# Altium project ESD_Battery-Monitor-System.PrjPcb
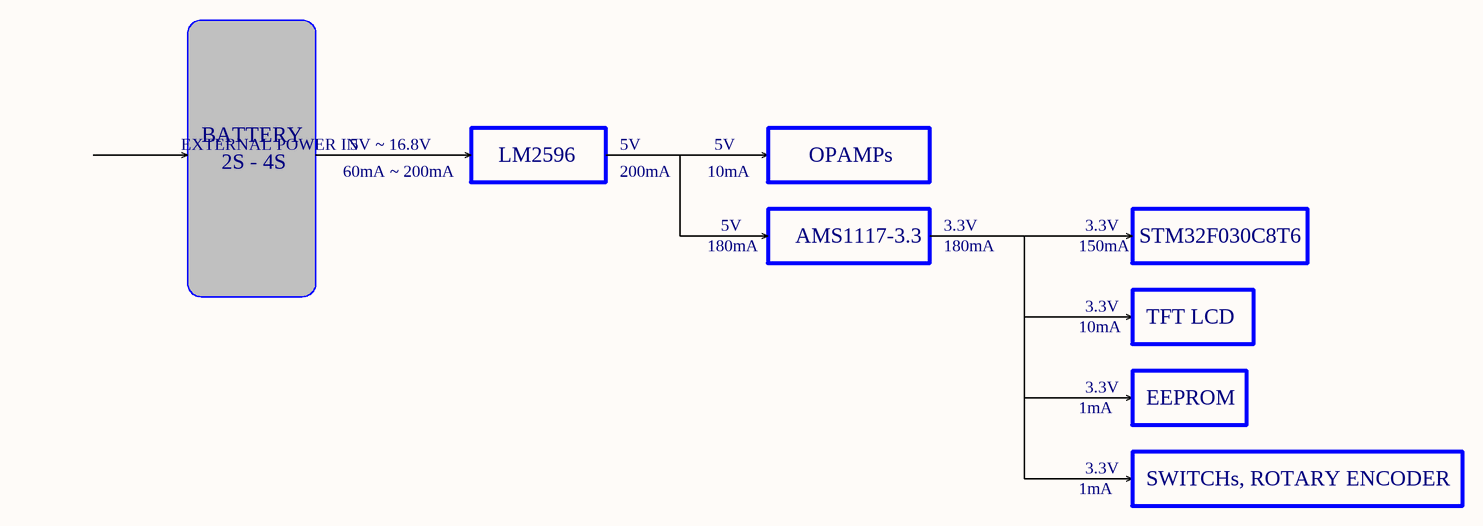
[diagram p0: Power_Diagram.SchDoc]
3 sheets, 101 parts. Net scope: global (net labels, ports and power ports of the same name join across sheets).
Board file: PCB_v1.PcbDoc
Sheets:
  Power_Diagram.SchDoc
  Power_Supply.SchDoc
  Voltage_Battery_Measure.SchDoc

## Sheet Power_Diagram.SchDoc
size A4; SheetNumber: 1; SheetTotal: 2

### Notes on the sheet
- EXTERNAL POWER IN
- BATTERY
- 2S - 4S
- 60mA ~ 200mA
- 5V ~ 16.8V
- LM2596
- 5V
- 200mA
- 10mA
- OPAMPs
- AMS1117-3.3
- 3.3V
- STM32F030C8T6
- 180mA
- 150mA
- TFT LCD
- 1mA
- EEPROM
- SWITCHs, ROTARY ENCODER

## Sheet Power_Supply.SchDoc
size A4; SheetNumber: 2; SheetTotal: 3
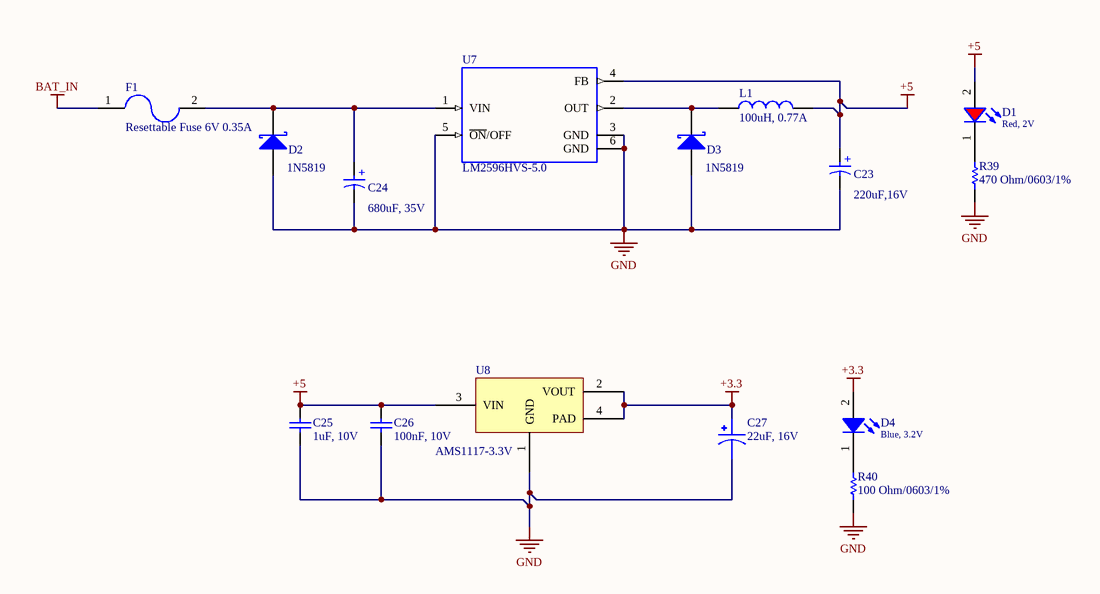
[diagram p1: Power_Supply.SchDoc]

### Parts
C23  value 220uF,16V  [WCAP-ASLI_D6.3H7.7]  (hidden comment: 220uF)
C24  value 680uF, 35V  [WCAP-ASLI_D12.5H14]  (hidden comment: 680uF)
C25  1uF, 10V  [WCAP-CSGP_0603_H=0.8mm_Reflow]
C26  100nF, 10V  [WCAP-CSGP_0603_H=0.8mm_Reflow]
C27  value 22uF, 16V  [C2312]  (hidden comment: Tantalum Capacitor)
D1  Red, 2V  [WL-SMCW_0603 dome]
D2  value 1N5819  [SS34]  (hidden comment: D Schottky)
D3  value 1N5819  [SS34]  (hidden comment: D Schottky)
D4  Blue, 3.2V  [WL-SMCW_0603_H=0.7mm]
F1  value Resettable Fuse 6V 0.35A  [FUSE1206]  (hidden comment: RESETTABLE FUSE 1206)
L1  100uH, 0.77A  [WE-PD2A_7850]
R39  value 470 Ohm/0603/1%  [R0603]  (hidden comment: Resistor 470 Ohm 0603 1%)
R40  value 100 Ohm/0603/1%  [R0603]  (hidden comment: Resistor 100 Ohm 0603 1%)
U7  value LM2596HVS-5.0  [TO-263-5]  (hidden comment: LM2596)
U8  AMS1117-3.3V  [SOT230P700X180-4N]

### Nets
+3.3: C27.1 D4.2(A) U8.2(VOUT) U8.4(PAD)
+5: C23.1(P) C25.2 C26.2 D1.2(A) L1.2 U7.4(FB) U8.3(VIN)
BAT_IN: F1.1  [project net SHUNT+]
GND: C23.2(N) C24.2(N) C25.1 C26.1 C27.2 D2.1(A) D3.1(A) R39.1 R40.1 U7.3(GND) U7.5(~{ON}/OFF) U7.6(GND) U8.1(GND)
NetC24_1: C24.1(P) D2.2(K) F1.2 U7.1(VIN)
NetD1_1: D1.1(K) R39.2
NetD3_2: D3.2(K) L1.1 U7.2(OUT)
NetD4_1: D4.1(K) R40.2

### Notes on the sheet
- (in symbol 865080345012) +
- (in symbol 865080562017) +

### Library data of the parts
C23 = 865080345012: WCAP-ASLI Aluminum Electrolytic Capacitor, V-Chip, D6.3 x H7.7mm, 220uF, 16V; Manufacturer: Wurth Elektronik; Capacitance Tolerance: +/-20%; Dissipation Factor: 16%; Endurance: 2000h; Leakage Current: 35.2uA; Ripple Current: 275mA; Technical Reference: ASED077221M016DVCTCB000; Manufacturer Part Number: 865080345012; Category: Aluminum Electrolytic Capacitors; Match Code: WCAP-ASLI; ComponentLink1Description: Website Link; ComponentLink1URL: https://www.we-online.com/redexpert/article/865080345012?ad; ComponentLink2Description: Datasheet Link; ComponentLink2URL: https://www.we-online.com/redexpert/spec/865080345012?ad; Mount: Surface Mount; Operating Temperature Max: 105°C; Operating Temperature Min: -55°C; Packaging: Tape and Reel; Height: 7.7mm; Diameter: 6.3mm; Rated Voltage (DC): 16V
C24 = 865080562017: WCAP-ASLI Aluminum Electrolytic Capacitor, V-Chip, D12.5 x H14mm, 680uF, 35V; Manufacturer: Wurth Elektronik; Capacitance Tolerance: +/-20%; Dissipation Factor: 14%; Endurance: 5000h; Leakage Current: 238uA; Ripple Current: 1100mA; Technical Reference: ASEH140681M035DVCTGE000; Manufacturer Part Number: 865080562017; Category: Aluminum Electrolytic Capacitors; Match Code: WCAP-ASLI; ComponentLink1Description: Website Link; ComponentLink1URL: https://www.we-online.com/redexpert/article/865080562017?ad; ComponentLink2Description: Datasheet Link; ComponentLink2URL: https://www.we-online.com/redexpert/spec/865080562017?ad; Mount: Surface Mount; Operating Temperature Max: 105°C; Operating Temperature Min: -55°C; Packaging: Tape and Reel; Height: 14mm; Diameter: 12.5mm; Rated Voltage (DC): 35V
C25 = 885012106010: WCAP-CSGP Multilayer Ceramic Chip Capacitor, General Purpose, size 0603, X5R, 1uF, 10V; Manufacturer: Wurth Elektronik; Rated Voltage: 10VDC; Isolation Resistance: >=0.1GOhm; Capacitance Tolerance: +/-20%; Technical Reference: X5R0603105M010DFCT10000; ComponentLink1Description: Manufacturer; ComponentLink1URL: http://www.we-online.de; ComponentLink2Description: Datasheet; ComponentLink2URL: https://www.we-online.com/catalog/datasheet/885012106010.pdf; Operating Temperature: -55 to +85degC; Packaging: Tape and Reel; Manufacturer Part Number: 885012106010; Published Date: May 2020; Ceramic Type: X5R; Dissipation Factor: =<10%; Height: 0.8mm; Mounting Technology: SMT; Size: 0603; Capacitance: 1uF
C26 = 885012206020: WCAP-CSGP Multilayer Ceramic Chip Capacitor, General Purpose, size 0603, X7R, 100nF, 10V; Manufacturer: Wurth Elektronik; Rated Voltage: 10VDC; Isolation Resistance: >=5GOhm; Capacitance Tolerance: +/-10%; Technical Reference: X7R0603104K010DFCT10000; ComponentLink1Description: Manufacturer; ComponentLink1URL: http://www.we-online.de; ComponentLink2Description: Datasheet; ComponentLink2URL: https://www.we-online.com/catalog/datasheet/885012206020.pdf; Operating Temperature: -55 to +125degC; Packaging: Tape and Reel; Manufacturer Part Number: 885012206020; Published Date: May 2020; Ceramic Type: X7R; Dissipation Factor: =<5%; Height: 0.8mm; Mounting Technology: SMT; Size: 0603; Capacitance: 100nF
C27 = Tantalum Capacitor: Code 226 10%, 2312 (6032 Metric); MF: AVX; MP: TAJC226K016RNJ; Mouser-Purchase-URL: https://snapeda.com/shop?store=Mouser&id=1681916; Price: None; Package: 2312 AVX; Availability: Warning; SnapEDA_Link: https://www.snapeda.com/parts/TAJC226K016RNJ/AVX/view-part/1681916/?ref=snap
D1 = 150060RS86000: WL-SMCW SMT Mono-color Chip LED Waterclear, size 0603 dome, Red, 2V, 60deg; Chip Technology: AlInGaP; Dominant Wavelength typ.: 624nm; Luminous Intensity typ.: 800mcd; Peak Wavelength typ.: 632nm; Viewing Angle: 60deg; ComponentLink1Description: Manufacturer; ComponentLink1URL: http://www.we-online.de; ComponentLink2URL: https://www.we-online.com/catalog/datasheet/150060RS86000.pdf; ComponentLink2Description: Datasheet; Forward Voltage typ.: 2V; Emitting Color: Red; Mounting Technology: SMT; Operating Temperature: -40 to +85degC; Published Date: December 2019; Part Number: 150060RS86000; Packaging: Tape and Reel; Size: 0603 dome; Publisher: Wurth Elektronik
D2 D3 = D Schottky: Schottky Diode; Published: 8-Jun-2000; LatestRevisionDate: 17-Jul-2002; LatestRevisionNote: Re-released for DXP Platform.; PackageReference: SMB; Publisher: Altium Limited; PackageDescription: DO-214-AA/SMB; 2 C-Bend Leads; Body 5.3 x 3.6 mm, inc. leads (LxW); Code_JEDEC: DO-214-AA
D4 = 150060BS75000: WL-SMCW SMT Mono-color Chip LED Waterclear, size 0603, Blue, 3.2V, 140deg; Chip Technology: InGaN; Dominant Wavelength typ.: 470nm; Luminous Intensity typ.: 145mcd; Peak Wavelength typ.: 465nm; Viewing Angle: 140deg; ComponentLink1Description: Manufacturer; ComponentLink1URL: http://www.we-online.de; ComponentLink2URL: https://www.we-online.com/catalog/datasheet/150060BS75000.pdf; ComponentLink2Description: Datasheet; Forward Voltage typ.: 3.2V; Emitting Color: Blue; Mounting Technology: SMT; Operating Temperature: -40 to +85degC; Published Date: December 2019; Part Number: 150060BS75000; Packaging: Tape and Reel; Size: 0603; Publisher: Wurth Elektronik
F1 = RESETTABLE FUSE 1206: Polymeric PTC Resettable Fuse 6V 350mA Ih Surface Mount 1206 _3216 Metric_, Concave; MF: Littelfuse Inc.; MP: 1206L035YR; Package: 1206 Littelfuse; Price: None; Availability: Unavailable; SnapEDA_Link: https://www.snapeda.com/parts/1206L035YR/Littelfuse%20Inc./view-part/225191/?ref=snap
L1 = 78477520: WE-PD2A SMT Power Inductor, size 7850, 100uH, 0.77A; Manufacturer: Wurth Elektronik; DC Resistance max.: 0.43Ohm; Saturation Current: 0.86A; Self Resonant Frequency: 7MHz; DC Resistance typ.: 0.281Ohm; Rated Voltage: 80VDC; ComponentLink1Description: Manufacturer; ComponentLink1URL: http://www.we-online.de; ComponentLink2Description: Datasheet; ComponentLink2URL: https://www.we-online.com/catalog/datasheet/78477520.pdf; Manufacturer Part Number: 78477520; Published Date: May 2020; Rated Current: 0.77A; Inductance: 100uH; Operating Temperature: -40 to +125degC; Mounting Technology: SMT; Packaging: Tape and Reel; Size: 7850
R39 = Resistor 470 Ohm 0603 1%: Code 471, 1/10W; ComponentLink1Description: Buy; ComponentLink1URL: https://www.thegioiic.com/dien-tro-470-ohm-0603-1-
R40 = Resistor 100 Ohm 0603 1%: Code 1000, 1/10W; ComponentLink1Description: Buy; ComponentLink1URL: https://www.thegioiic.com/dien-tro-100-ohm-0603-1-
U7 = LM2596: Simple Switcher Power Converter 150-kHz 4V to 60V, 3A Step-Down Voltage Regulator; MF: Texas Instruments; MP: LM2576HVS-5.0/NOPB; Purchase-URL: https://pricing.snapeda.com/search/part/LM2576HVS-5.0/NOPB/?ref=eda; Package: TO-263-5 Texas Instruments; Check_prices: https://www.snapeda.com/parts/LM2576HVS-5.0/NOPB/Texas+Instruments/view-part/?ref=eda; SnapEDA_Link: https://www.snapeda.com/parts/LM2576HVS-5.0/NOPB/Texas+Instruments/view-part/?ref=snap; Availability: In Stock; Price: None

## Sheet Voltage_Battery_Measure.SchDoc
size A3; SheetNumber: 3; SheetTotal: 3
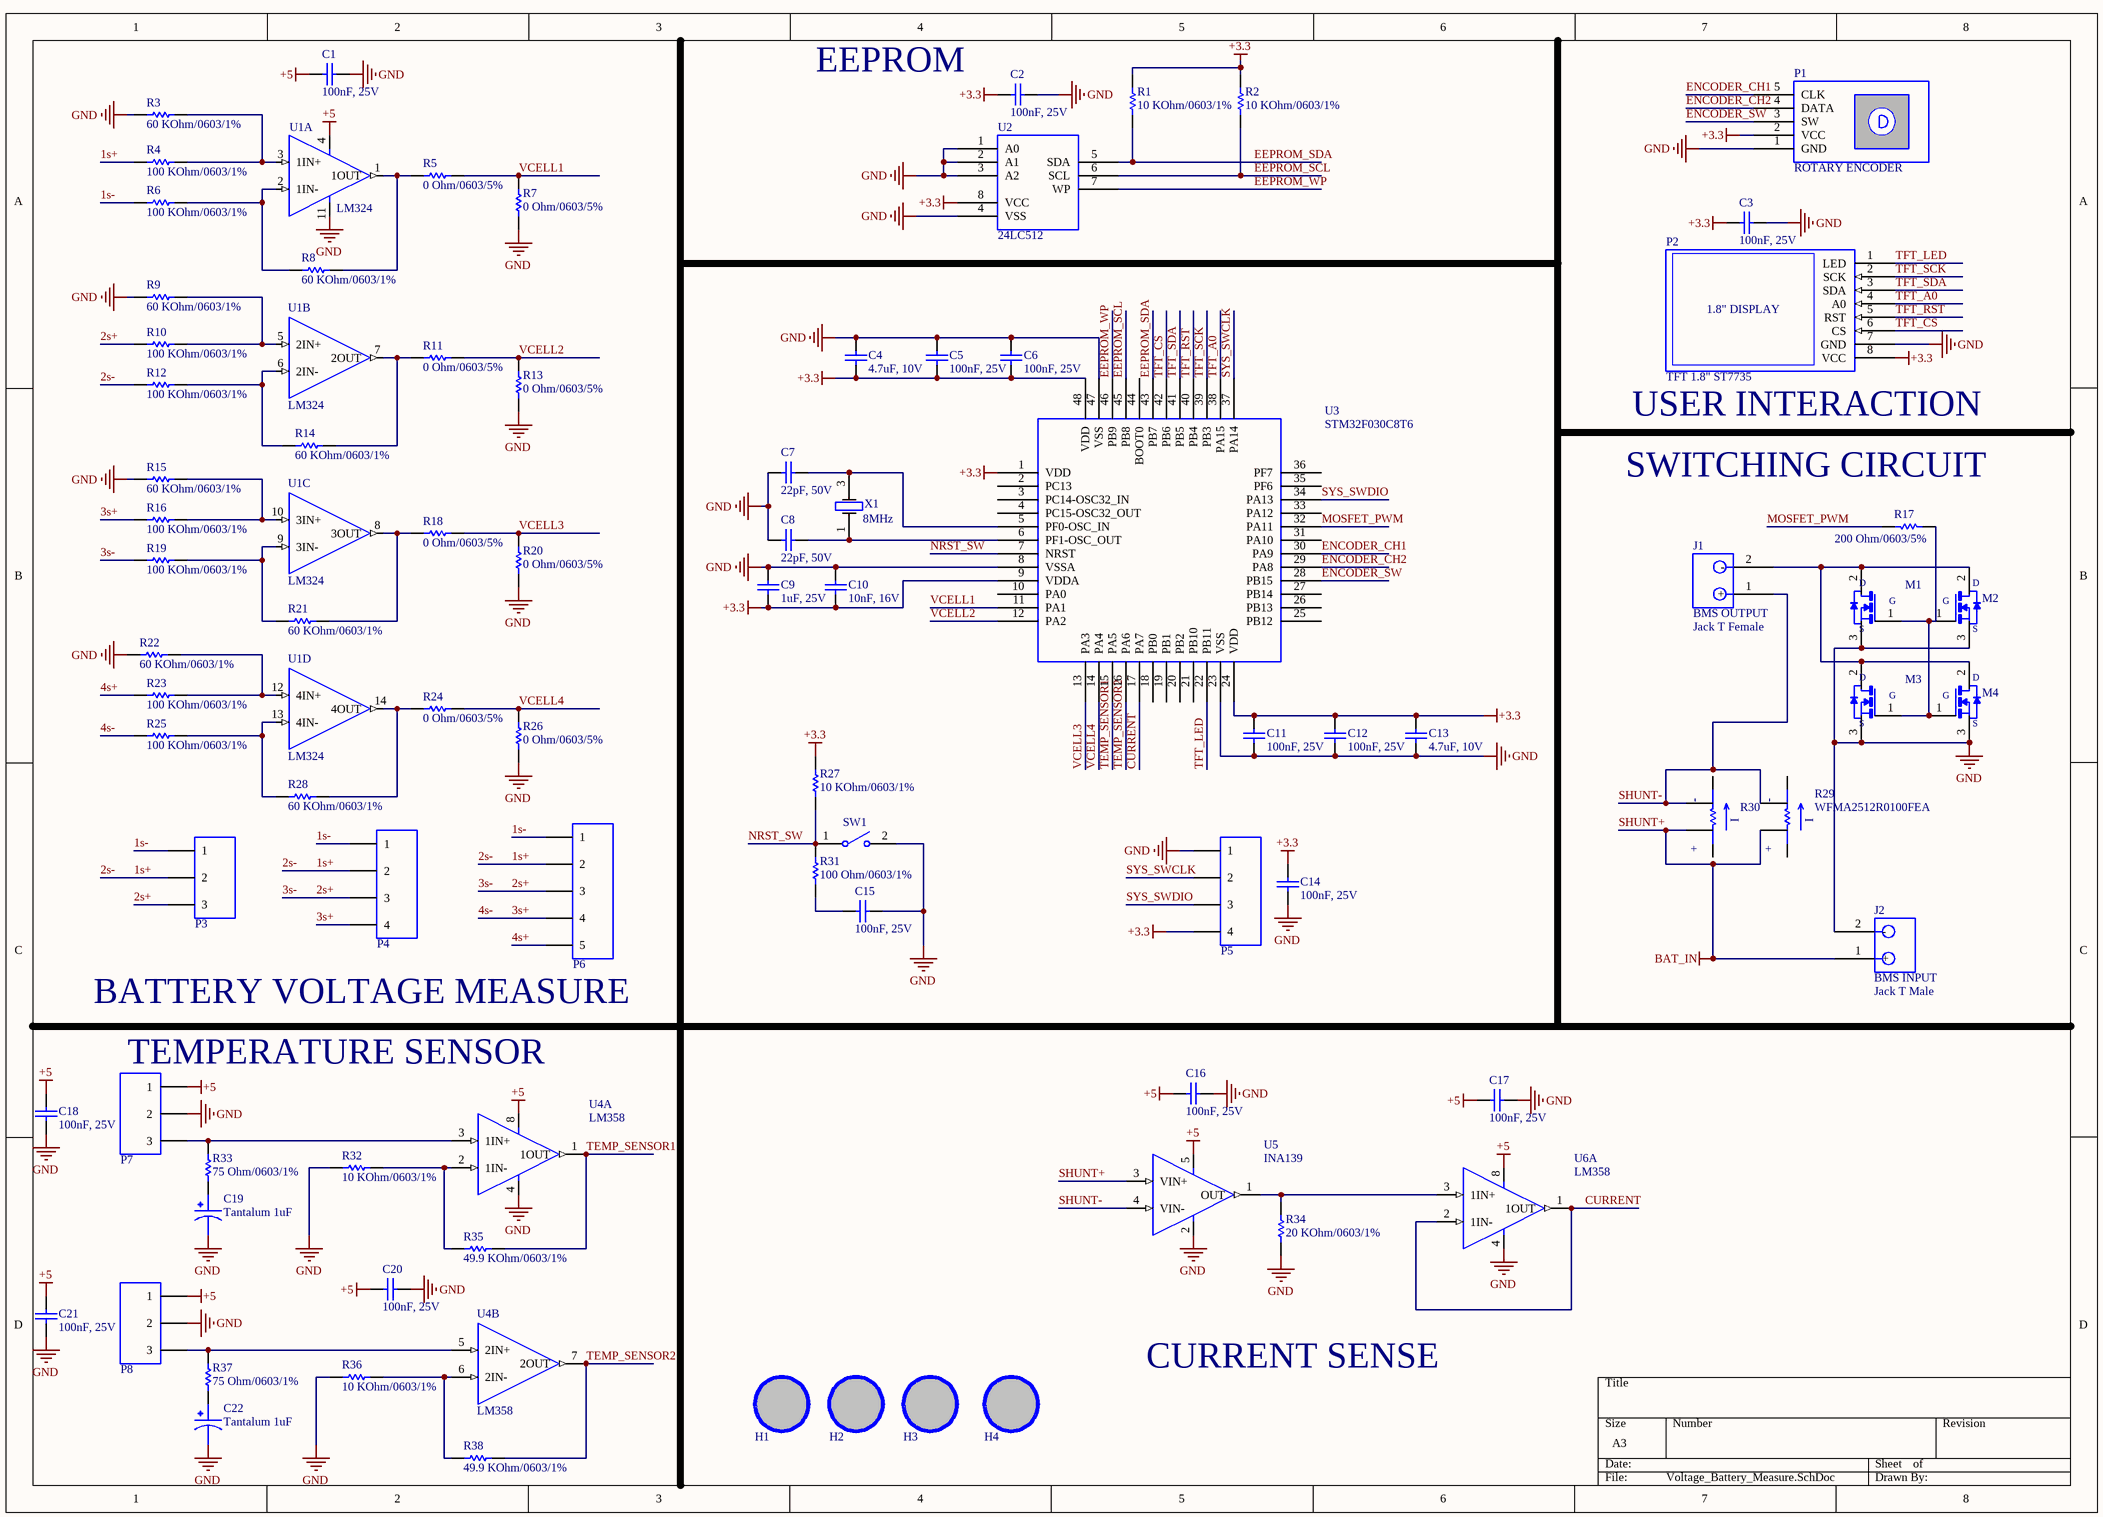
[diagram p2: Voltage_Battery_Measure.SchDoc]

### Parts
C1  100nF, 25V  [WCAP-CSGP_0603_H=0.8mm_Reflow]
C2  100nF, 25V  [WCAP-CSGP_0603_H=0.8mm_Reflow]
C3  100nF, 25V  [WCAP-CSGP_0603_H=0.8mm_Reflow]
C4  4.7uF, 10V  [WCAP-CSGP_0603_H=0.8mm_Reflow]
C5  100nF, 25V  [WCAP-CSGP_0603_H=0.8mm_Reflow]
C6  100nF, 25V  [WCAP-CSGP_0603_H=0.8mm_Reflow]
C7  22pF, 50V  [WCAP-CSGP_0603_H=0.8mm_Reflow]
C8  22pF, 50V  [WCAP-CSGP_0603_H=0.8mm_Reflow]
C9  1uF, 25V  [WCAP-CSGP_0603_H=0.8mm_Reflow]
C10  10nF, 16V  [WCAP-CSGP_0603_H=0.8mm_Reflow]
C11  100nF, 25V  [WCAP-CSGP_0603_H=0.8mm_Reflow]
C12  100nF, 25V  [WCAP-CSGP_0603_H=0.8mm_Reflow]
C13  4.7uF, 10V  [WCAP-CSGP_0603_H=0.8mm_Reflow]
C14  100nF, 25V  [WCAP-CSGP_0603_H=0.8mm_Reflow]
C15  100nF, 25V  [WCAP-CSGP_0603_H=0.8mm_Reflow]
C16  100nF, 25V  [WCAP-CSGP_0603_H=0.8mm_Reflow]
C17  100nF, 25V  [WCAP-CSGP_0603_H=0.8mm_Reflow]
C18  100nF, 25V  [WCAP-CSGP_0603_H=0.8mm_Reflow]
C19  value Tantalum 1uF  [C1206]  (hidden comment: Tantalum Capacitor)
C20  100nF, 25V  [WCAP-CSGP_0603_H=0.8mm_Reflow]
C21  100nF, 25V  [WCAP-CSGP_0603_H=0.8mm_Reflow]
C22  value Tantalum 1uF  [C1206]  (hidden comment: Tantalum Capacitor)
H1  Hole  [LO KHOAN 3MM]  (value not drawn)
H2  Hole  [LO KHOAN 3MM]  (value not drawn)
H3  Hole  [LO KHOAN 3MM]  (value not drawn)
H4  Hole  [LO KHOAN 3MM]  (value not drawn)
J1  BMS OUTPUT  value Jack T Female  [Jack T - FEMALE]
J2  BMS INPUT  value Jack T Male  [Jack T - Male]
M1  AOD472  [TO252-3]  (value not drawn)
M2  AOD472  [TO252-3]  (value not drawn)
M3  AOD472  [TO252-3]  (value not drawn)
M4  AOD472  [TO252-3]  (value not drawn)
P1  Rotary Encoder  [Rotary Encoder]
P2  TFT 1.8" ST7735  [JP8]
P3  Header 3H  [JP3H]  (value not drawn)
P4  Header 4H  [JP4H]  (value not drawn)
P5  Header 4H  [JP4H]  (value not drawn)
P6  Header 5H  [JP5H]  (value not drawn)
P7  Header 3H  [JP3H]  (value not drawn)
P8  Header 3H  [JP3H]  (value not drawn)
R1  value 10 KOhm/0603/1%  [R0603]  (hidden comment: Resistor 10 KOhm 0603 1%)
R2  value 10 KOhm/0603/1%  [R0603]  (hidden comment: Resistor 10 KOhm 0603 1%)
R3  value 60 KOhm/0603/1%  [R0603]  (hidden comment: Resistor 60 KOhm 0603 1%)
R4  value 100 KOhm/0603/1%  [R0603]  (hidden comment: Resistor 100 KOhm 0603 1%)
R5  value 0 Ohm/0603/5%  [R0603]  (hidden comment: Resistor 0 Ohm 0603 5%)
R6  value 100 KOhm/0603/1%  [R0603]  (hidden comment: Resistor 100 KOhm 0603 1%)
R7  value 0 Ohm/0603/5%  [R0603]  (hidden comment: Resistor 0 Ohm 0603 5%)
R8  value 60 KOhm/0603/1%  [R0603]  (hidden comment: Resistor 60 KOhm 0603 1%)
R9  value 60 KOhm/0603/1%  [R0603]  (hidden comment: Resistor 60 KOhm 0603 1%)
R10  value 100 KOhm/0603/1%  [R0603]  (hidden comment: Resistor 100 KOhm 0603 1%)
R11  value 0 Ohm/0603/5%  [R0603]  (hidden comment: Resistor 0 Ohm 0603 5%)
R12  value 100 KOhm/0603/1%  [R0603]  (hidden comment: Resistor 100 KOhm 0603 1%)
R13  value 0 Ohm/0603/5%  [R0603]  (hidden comment: Resistor 0 Ohm 0603 5%)
R14  value 60 KOhm/0603/1%  [R0603]  (hidden comment: Resistor 60 KOhm 0603 1%)
R15  value 60 KOhm/0603/1%  [R0603]  (hidden comment: Resistor 60 KOhm 0603 1%)
R16  value 100 KOhm/0603/1%  [R0603]  (hidden comment: Resistor 100 KOhm 0603 1%)
R17  value 200 Ohm/0603/5%  [R0603]  (hidden comment: Resistor 200 Ohm 0603 5%)
R18  value 0 Ohm/0603/5%  [R0603]  (hidden comment: Resistor 0 Ohm 0603 5%)
R19  value 100 KOhm/0603/1%  [R0603]  (hidden comment: Resistor 100 KOhm 0603 1%)
R20  value 0 Ohm/0603/5%  [R0603]  (hidden comment: Resistor 0 Ohm 0603 5%)
R21  value 60 KOhm/0603/1%  [R0603]  (hidden comment: Resistor 60 KOhm 0603 1%)
R22  value 60 KOhm/0603/1%  [R0603]  (hidden comment: Resistor 60 KOhm 0603 1%)
R23  value 100 KOhm/0603/1%  [R0603]  (hidden comment: Resistor 100 KOhm 0603 1%)
R24  value 0 Ohm/0603/5%  [R0603]  (hidden comment: Resistor 0 Ohm 0603 5%)
R25  value 100 KOhm/0603/1%  [R0603]  (hidden comment: Resistor 100 KOhm 0603 1%)
R26  value 0 Ohm/0603/5%  [R0603]  (hidden comment: Resistor 0 Ohm 0603 5%)
R27  value 10 KOhm/0603/1%  [R0603]  (hidden comment: Resistor 10 KOhm 0603 1%)
R28  value 60 KOhm/0603/1%  [R0603]  (hidden comment: Resistor 60 KOhm 0603 1%)
R29  value WFMA2512R0100FEA  [R2512]  (hidden comment: Current Sense Resistor)
R30  Current Sense Resistor  [R2512]  (value not drawn)
R31  value 100 Ohm/0603/1%  [R0603]  (hidden comment: Resistor 100 Ohm 0603 1%)
R32  value 10 KOhm/0603/1%  [R0603]  (hidden comment: Resistor 10 KOhm 0603 1%)
R33  value 75 Ohm/0603/1%  [R0603]  (hidden comment: Resistor 75 Ohm 0603 1%)
R34  value 20 KOhm/0603/1%  [R0603]  (hidden comment: Resistor 20 KOhm 0603 1%)
R35  value 49.9 KOhm/0603/1%  [R0603]  (hidden comment: Resistor 49.9 KOhm 0603 1%)
R36  value 10 KOhm/0603/1%  [R0603]  (hidden comment: Resistor 10 KOhm 0603 1%)
R37  value 75 Ohm/0603/1%  [R0603]  (hidden comment: Resistor 75 Ohm 0603 1%)
R38  value 49.9 KOhm/0603/1%  [R0603]  (hidden comment: Resistor 49.9 KOhm 0603 1%)
SW1  434123050816  [WS-TASV_L6W3.5H5_4341x30508x6]  (value not drawn)
U1  LM324  [SOIC-14]  (parts A,B,C,D of 4)
U2  value 24LC512  [SOIC-8]  (hidden comment: 24LCxx)
U3  STM32F030C8T6  [48-LQFP]
U4  LM358  [SOIC-8]  (parts A,B of 2)
U5  INA139  [SOT-23]
U6  LM358  [SOIC-8]  (part A of 2)
X1  value 8MHz  [XTAL 3225]  (hidden comment: XTAL)

### Nets
+3.3: C2.2 C3.2 C4.1 C5.1 C6.1 C9.1 C10.1 C11.2 C12.2 C13.2 C14.2 P1.2(VCC) P2.8(VCC) P5.4 R1.2 R2.2 R27.2 U2.8(VCC) U3.1(VDD) U3.9(VDDA) U3.24(VDD) U3.48(VDD)
+5: C1.2 C16.2 C17.2 C18.2 C20.2 C21.2 P7.1 P8.1 U1.4(VCC+) U4.8(VCC+) U5.5(VCC+) U6.8(VCC+)
GND: C1.1 C2.1 C3.1 C4.2 C5.2 C6.2 C7.1 C8.1 C9.2 C10.2 C11.1 C12.1 C13.1 C14.1 C15.1 C16.1 C17.1 C18.1 C19.2 C20.1 C21.1 C22.2 J2.2(-) M1.3(S) M2.3(S) M3.3(S) M4.3(S) P1.1(GND) P2.7(GND) P5.1 P7.2 P8.2 R3.2 R7.1 R9.2 R13.1 R15.2 R20.1 R22.2 R26.1 R32.2 R34.1 R36.2 SW1.2 U1.11(VCC-) U2.1(A0) U2.2(A1) U2.3(A2) U2.4(VSS) U3.8(VSSA) U3.23(VSS) U3.47(VSS) U4.4(VCC-) U5.2(VCC-) U6.4(VCC-)
SHUNT+: J2.1(+) R29.1 R30.1 U5.3(VIN+)  [also labelled BAT_IN]
1s+: P3.2 P4.2 P6.2 R4.1 R12.1  [also labelled 2s-]
1s-: P3.1 P4.1 P6.1 R6.1
2s+: P3.3 P4.3 P6.3 R10.1 R19.1  [also labelled 3s-]
3s+: P4.4 P6.4 R16.1 R25.1  [also labelled 4s-]
4s+: P6.5 R23.1
CURRENT: U3.17(PA7) U6.1(1OUT) U6.2(1IN-)
EEPROM_SCL: R2.1 U2.6(SCL) U3.45(PB8)
EEPROM_SDA: R1.1 U2.5(SDA) U3.43(PB7)
EEPROM_WP: U2.7(WP) U3.46(PB9)
ENCODER_CH1: P1.5(CLK) U3.30(PA9)
ENCODER_CH2: P1.4(DATA) U3.29(PA8)
ENCODER_SW: P1.3(SW) U3.28(PB15)
MOSFET_PWM: R17.2 U3.32(PA11)
NRST_SW: R27.1 R31.2 SW1.1 U3.7(NRST)
SHUNT-: J1.1(+) R29.2 R30.2 U5.4(VIN-)
SYS_SWCLK: P5.2 U3.37(PA14)
SYS_SWDIO: P5.3 U3.34(PA13)
TEMP_SENSOR1: R35.2 U3.15(PA5) U4.1(1OUT)
TEMP_SENSOR2: R38.2 U3.16(PA6) U4.7(2OUT)
TFT_A0: P2.4(A0) U3.38(PA15)
TFT_CS: P2.6(CS) U3.42(PB6)
TFT_LED: P2.1(LED) U3.22(PB11)
TFT_RST: P2.5(RST) U3.40(PB4)
TFT_SCK: P2.2(SCK) U3.39(PB3)
TFT_SDA: P2.3(SDA) U3.41(PB5)
VCELL1: R5.2 R7.2 U3.11(PA1)
VCELL2: R11.2 R13.2 U3.12(PA2)
VCELL3: R18.2 R20.2 U3.13(PA3)
VCELL4: R24.2 R26.2 U3.14(PA4)
NetC7_2: C7.2 U3.5(PF0-OSC_IN) X1.3
NetC8_2: C8.2 U3.6(PF1-OSC_OUT) X1.1
NetC15_2: C15.2 R31.1
NetC19_1: C19.1 R33.1
NetC22_1: C22.1 R37.1
NetJ1_2: J1.2(-) M1.2(D) M2.2(D) M3.2(D) M4.2(D)
NetM1_1: M1.1(G) M2.1(G) M3.1(G) M4.1(G) R17.1
NetP7_3: P7.3 R33.2 U4.3(1IN+)
NetP8_3: P8.3 R37.2 U4.5(2IN+)
NetR3_1: R3.1 R4.2 U1.3(1IN+)
NetR5_1: R5.1 R8.2 U1.1(1OUT)
NetR6_2: R6.2 R8.1 U1.2(1IN-)
NetR9_1: R9.1 R10.2 U1.5(2IN+)
NetR11_1: R11.1 R14.2 U1.7(2OUT)
NetR12_2: R12.2 R14.1 U1.6(2IN-)
NetR15_1: R15.1 R16.2 U1.10(3IN+)
NetR18_1: R18.1 R21.2 U1.8(3OUT)
NetR19_2: R19.2 R21.1 U1.9(3IN-)
NetR22_1: R22.1 R23.2 U1.12(4IN+)
NetR24_1: R24.1 R28.2 U1.14(4OUT)
NetR25_2: R25.2 R28.1 U1.13(4IN-)
NetR32_1: R32.1 R35.1 U4.2(1IN-)
NetR34_2: R34.2 U5.1(OUT) U6.3(1IN+)
NetR36_1: R36.1 R38.1 U4.6(2IN-)

Not connected (* = marked no-connect by the designer): H1 1; H2 1; H3 1; H4 1; U3 2(PC13) 3(PC14-OSC32_IN) 4(PC15-OSC32_OUT) 10(PA0) 18(PB0) 19(PB1) 20(PB2) 21(PB10) 25(PB12) 26(PB13) 27(PB14) 31(PA10) 33(PA12) 35(PF6) 36(PF7) 44(BOOT0)

### Notes on the sheet
- EEPROM
- (near P2) USER INTERACTION
- (near R17) SWITCHING CIRCUIT
- BATTERY VOLTAGE MEASURE
- (near P7) TEMPERATURE SENSOR
- CURRENT SENSE
- (in symbol Current Sense Resistor) I
- (in symbol TFT 1.8" ST7735) 1.8" DISPLAY

### Library data of the parts
C1-C3 C5 C6 C11 C12 C14-C18 C20 C21 = 885012206071: WCAP-CSGP Multilayer Ceramic Chip Capacitor, General Purpose, size 0603, X7R, 100nF, 25V; Manufacturer: Wurth Elektronik; Rated Voltage: 25VDC; Isolation Resistance: >=5GOhm; Capacitance Tolerance: +/-10%; Technical Reference: X7R0603104K025DFCT10000; ComponentLink1Description: Manufacturer; ComponentLink1URL: http://www.we-online.de; ComponentLink2Description: Datasheet; ComponentLink2URL: https://www.we-online.com/catalog/datasheet/885012206071.pdf; Operating Temperature: -55 to +125degC; Packaging: Tape and Reel; Manufacturer Part Number: 885012206071; Published Date: May 2020; Ceramic Type: X7R; Dissipation Factor: =<3.5%; Height: 0.8mm; Mounting Technology: SMT; Size: 0603
  C1 C3 C5 C6 C11 C12 C14-C18 C20 C21: Capacitance: 100nF
  C2: Value: 100nF, 25V
C4 C13 = 885012106012: WCAP-CSGP Multilayer Ceramic Chip Capacitor, General Purpose, size 0603, X5R, 4.7uF, 10V; Manufacturer: Wurth Elektronik; Rated Voltage: 10VDC; Isolation Resistance: >=0.02GOhm; Capacitance Tolerance: +/-20%; Technical Reference: X5R0603475M010DFCT10000; ComponentLink1Description: Manufacturer; ComponentLink1URL: http://www.we-online.de; ComponentLink2Description: Datasheet; ComponentLink2URL: https://www.we-online.com/catalog/datasheet/885012106012.pdf; Operating Temperature: -55 to +85degC; Packaging: Tape and Reel; Manufacturer Part Number: 885012106012; Published Date: May 2020; Ceramic Type: X5R; Dissipation Factor: =<10%; Height: 0.8mm; Mounting Technology: SMT; Size: 0603; Capacitance: 4.7uF
C7 C8 = 885012006053: WCAP-CSGP Multilayer Ceramic Chip Capacitor, General Purpose, size 0603, NP0, 22pF, 50V; Manufacturer: Wurth Elektronik; Rated Voltage: 50VDC; Isolation Resistance: >=10GOhm; Capacitance Tolerance: +/-5%; Dissipation Factor: Q>=400+20C; Technical Reference: NP00603220J050DFCT10000; ComponentLink1Description: Manufacturer; ComponentLink1URL: http://www.we-online.de; ComponentLink2Description: Datasheet; ComponentLink2URL: https://www.we-online.com/catalog/datasheet/885012006053.pdf; Operating Temperature: -55 to +125degC; Packaging: Tape and Reel; Manufacturer Part Number: 885012006053; Published Date: May 2020; Ceramic Type: NP0; Height: 0.8mm; Mounting Technology: SMT; Size: 0603; Capacitance: 22pF
C9 = 885012106022: WCAP-CSGP Multilayer Ceramic Chip Capacitor, General Purpose, size 0603, X5R, 1uF, 25V; Manufacturer: Wurth Elektronik; Rated Voltage: 25VDC; Isolation Resistance: >=0.5GOhm; Capacitance Tolerance: +/-20%; Technical Reference: X5R0603105M025DFCT10000; ComponentLink1Description: Manufacturer; ComponentLink1URL: http://www.we-online.de; ComponentLink2Description: Datasheet; ComponentLink2URL: https://www.we-online.com/catalog/datasheet/885012106022.pdf; Operating Temperature: -55 to +85degC; Packaging: Tape and Reel; Manufacturer Part Number: 885012106022; Published Date: May 2020; Ceramic Type: X5R; Dissipation Factor: =<10%; Height: 0.8mm; Mounting Technology: SMT; Size: 0603; Capacitance: 1uF
C10 = 885012206040: WCAP-CSGP Multilayer Ceramic Chip Capacitor, General Purpose, size 0603, X7R, 10nF, 16V; Manufacturer: Wurth Elektronik; Rated Voltage: 16VDC; Isolation Resistance: >=10GOhm; Capacitance Tolerance: +/-10%; Technical Reference: X7R0603103K016DFCT10000; ComponentLink1Description: Manufacturer; ComponentLink1URL: http://www.we-online.de; ComponentLink2Description: Datasheet; ComponentLink2URL: https://www.we-online.com/catalog/datasheet/885012206040.pdf; Operating Temperature: -55 to +125degC; Packaging: Tape and Reel; Manufacturer Part Number: 885012206040; Published Date: May 2020; Ceramic Type: X7R; Dissipation Factor: =<3.5%; Height: 0.8mm; Mounting Technology: SMT; Size: 0603; Capacitance: 10nF
C19 C22 = Tantalum Capacitor: Code 105 10%, 1206 (3216 Metric); MF: AVX; MP: TAJC226K016RNJ; Mouser-Purchase-URL: https://snapeda.com/shop?store=Mouser&id=1681916; Price: None; Package: 2312 AVX; Availability: Warning; SnapEDA_Link: https://www.snapeda.com/parts/TAJC226K016RNJ/AVX/view-part/1681916/?ref=snap
H1-H4 = Hole: Hole 3mm
J1 = Jack T Female: Jack T 120A; ComponentLink1Description: Buy; ComponentLink1URL: https://www.thegioiic.com/jack-cam-chu-t-duc
J2 = Jack T Male: Jack T 120A; ComponentLink1Description: Buy; ComponentLink1URL: https://www.thegioiic.com/jack-cam-chu-t-duc
M1-M4 = AOD472: MOSFET 25V 55A N-Channel; ComponentLink1Description: Buy; ComponentLink1URL: https://www.thegioiic.com/aod472-mosfet-kenh-n-25v-55a-to-252-3; Value: AOD472
P1 = MODULE ROTARY ENCODER: KY-040; ComponentLink1Description: Buy; ComponentLink1URL: https://www.thegioiic.com/ky-040-mach-dieu-khien-goc-quay-encoder; Value: ROTARY ENCODER
P2 = TFT 1.8" ST7735: LCD 1.8inch 160x128 TFT ST7735; ComponentLink1Description: Buy; ComponentLink1URL: https://www.thegioiic.com/lcd-1-8inch-160x128-tft-st7735-giao-tiep-spi; Value: TFT 1.8" ST7735
P3 P7 P8 = Header 3H: Header, 3-Pin, Right Angle; LatestRevisionDate: 17-Jul-2002; LatestRevisionNote: Re-released for DXP Platform.; Publisher: Altium Limited; Value: Header 3H
P4 P5 = Header 4H: Header, 4-Pin, Right Angle; LatestRevisionDate: 17-Jul-2002; LatestRevisionNote: Re-released for DXP Platform.; Publisher: Altium Limited; Value: Header 4H
P6 = Header 5H: Header, 5-Pin, Right Angle; LatestRevisionDate: 17-Jul-2002; LatestRevisionNote: Re-released for DXP Platform.; Publisher: Altium Limited; Value: Header 5H
R1 R2 R27 R32 R36 = Resistor 10 KOhm 0603 1%: Code 103, 1/10W; ComponentLink1Description: Buy; ComponentLink1URL: https://www.thegioiic.com/dien-tro-10-kohm-0603-1-
R3 R8 R9 R14 R15 R21 R22 R28 = Resistor 60 KOhm 0603 1%: Code 603, 1/10W; ComponentLink1Description: Buy; ComponentLink1URL: https://www.thegioiic.com/dien-tro-60-kohm-0603-1-
R4 R6 R10 R12 R16 R19 R23 R25 = Resistor 100 KOhm 0603 1%: Code 104, 1/10W; ComponentLink1Description: Buy; ComponentLink1URL: https://www.thegioiic.com/dien-tro-100-kohm-0603-1-
R5 R7 R11 R13 R18 R20 R24 R26 = Resistor 0 Ohm 0603 5%: Code 0R, 1/10W; ComponentLink1Description: Buy; ComponentLink1URL: https://www.thegioiic.com/dien-tro-0-ohm-0603-5-
R17 = Resistor 200 Ohm 0603 5%: Code 201, 1/10W; ComponentLink1Description: Buy; ComponentLink1URL: https://www.thegioiic.com/dien-tro-200-ohm-0603-5-
R29 = Current Sense Resistor: Shunt Resistor; ComponentLink1Description: Buy; ComponentLink1URL: https://linhkien.cxt.vn/3121-wfma2512r0100fea-tro-001-ohms-1-3w.html
R30 = Current Sense Resistor: Shunt Resistor; Value: R; ComponentLink1Description: Buy; ComponentLink1URL: https://linhkien.cxt.vn/3121-wfma2512r0100fea-tro-001-ohms-1-3w.html
R31 = Resistor 100 Ohm 0603 1%: Code 1000, 1/10W; ComponentLink1Description: Buy; ComponentLink1URL: https://www.thegioiic.com/dien-tro-100-ohm-0603-1-
R33 R37 = Resistor 75 Ohm 0603 1%: Code 750, 1/10W; ComponentLink1Description: Buy; ComponentLink1URL: https://www.thegioiic.com/dien-tro-75-ohm-0603-1-
R34 = Resistor 20 KOhm 0603 1%: Code 203,1/10W; ComponentLink1Description: Buy; ComponentLink1URL: https://www.thegioiic.com/dien-tro-20-kohm-0603-1-
R35 R38 = Resistor 49.9 KOhm 0603 1%: Code (4992, 68C), 1/10W; ComponentLink1Description: Buy; ComponentLink1URL: https://www.thegioiic.com/dien-tro-49-9-kohm-0603-1-
SW1 = 434123050816: WS-TASV J-Bend SMT Tact Switch, 12VDC, 50mA, 160g, height 5mm; Manufacturer: Wurth Elektronik; Rated Voltage: 12V; Washable: No; Actuator Color: Black; Electrical Life: 50000Cycles; ComponentLink1Description: Manufacturer Link; ComponentLink1URL: http://www.we-online.de; ComponentLink2Description: Datasheet; ComponentLink2URL: https://www.we-online.com/catalog/datasheet/434123050816.pdf; Manufacturer Part Number: 434123050816; Contact Material: Stainless Steel; Mounting Technology: SMT; Contact Plating: Silver; Operation Force: 160g; Packaging: Tape and Reel; Terminal Material: Copper Alloy; Rated Current: 50mA; Terminal Plating: Silver; Height: 5mm; Length: 6mm; Operating Temperature max.: 85C; Operating Temperature min.: -40C; Width: 3.5mm
U1 = LM324: OPAMP General Purpose Amplifier 4 Circuit 1.2MHz; ComponentLink1Description: Buy; ComponentLink1URL: https://www.thegioiic.com/lm324dr-ic-opamp-general-purpose-amplifier-4-circuit-1-2mhz-14-soic; Value: LM324
U2 = 24LCxx: EEPROM
U4 U6 = LM358: General Purpose Amplifier 2 Circuit 1.1MHz; Value: LM358
U5 = INA139: High-Side Measurement Current Shunt Monitor; Value: INA139
U3 = STM32F030C8T6: ComponentLink1Description: Buy; ComponentLink1URL: *; Value: STM32F030C8T6

## Nets that join several sheets
+3.3: Power_Supply (C27.1 D4.2 U8.2 U8.4), Voltage_Battery_Measure (22 pins)
+5: Power_Supply (7 pins), Voltage_Battery_Measure (12 pins)
GND: Power_Supply (13 pins), Voltage_Battery_Measure (55 pins)
SHUNT+: Power_Supply (F1.1), Voltage_Battery_Measure (J2.1 R29.1 R30.1 U5.3)